# Altium project PSU.PrjPcb
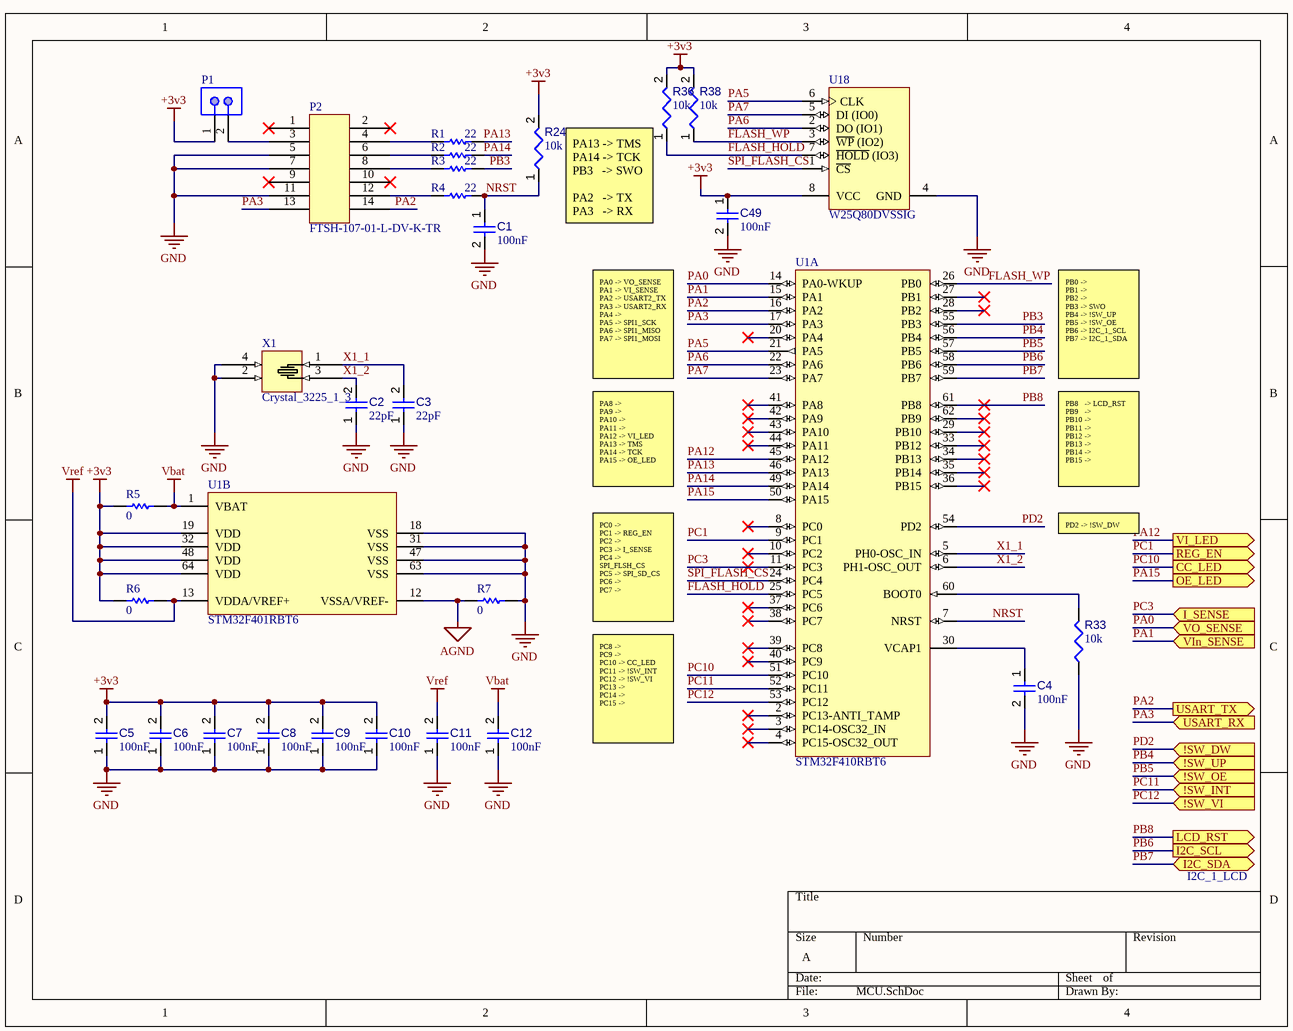
[diagram p0: MCU.SchDoc]
3 sheets, 127 parts. Net scope: flat (ports and power ports of the same name join across sheets).
Board file: PCB_V3.PcbDoc
Sheets:
  MCU.SchDoc
  UI.SchDoc
  Power.SchDoc

## Sheet MCU.SchDoc
size A

### Parts
C1  value 100nF  [CAPC2013X95X50ML10T25]  (hidden comment: Capacitor 100 nF +/-10% 50 V 0805)
C2  value 22pF  [CAPC2013X95X50ML10T25]  (hidden comment: Capacitor 100 nF +/-10% 50 V 0805)
C3  value 22pF  [CAPC2013X95X50ML10T25]  (hidden comment: Capacitor 100 nF +/-10% 50 V 0805)
C4  value 100nF  [CAPC2013X95X50ML10T25]  (hidden comment: Capacitor 100 nF +/-10% 50 V 0805)
C5  value 100nF  [CAPC2013X95X50ML10T25]  (hidden comment: Capacitor 100 nF +/-10% 50 V 0805)
C6  value 100nF  [CAPC2013X95X50ML10T25]  (hidden comment: Capacitor 100 nF +/-10% 50 V 0805)
C7  value 100nF  [CAPC2013X95X50ML10T25]  (hidden comment: Capacitor 100 nF +/-10% 50 V 0805)
C8  value 100nF  [CAPC2013X95X50ML10T25]  (hidden comment: Capacitor 100 nF +/-10% 50 V 0805)
C9  value 100nF  [CAPC2013X95X50ML10T25]  (hidden comment: Capacitor 100 nF +/-10% 50 V 0805)
C10  value 100nF  [CAPC2013X95X50ML10T25]  (hidden comment: Capacitor 100 nF +/-10% 50 V 0805)
C11  value 100nF  [CAPC2013X95X50ML10T25]  (hidden comment: Capacitor 100 nF +/-10% 50 V 0805)
C12  value 100nF  [CAPC2013X95X50ML10T25]  (hidden comment: Capacitor 100 nF +/-10% 50 V 0805)
C49  value 100nF  [CAPC2013X95X50LL10T25]  (hidden comment: Capacitor 100 nF +/-10% 50 V 0805)
P1  GRPB021VWVN-RC  [SLIN-GRPB021VWVN-RC_V]  (value not drawn)
P2  FTSH-107-01-L-DV-K-TR  [FTSH-107-01-L-DV-K-TR-Footprint-1]
R1  value 22  [RESC2013X50X35ML15T15]  (hidden comment: Resistor 0R +/- 1% 0805 125 mW)
R2  value 22  [RESC2013X50X35ML15T15]  (hidden comment: Resistor 0R +/- 1% 0805 125 mW)
R3  value 22  [RESC2013X50X35ML15T15]  (hidden comment: Resistor 0R +/- 1% 0805 125 mW)
R4  value 22  [RESC2013X50X35ML15T15]  (hidden comment: Resistor 0R +/- 1% 0805 125 mW)
R5  value 0  [RESC2013X50X35ML15T15]  (hidden comment: Resistor 0R +/- 1% 0805 125 mW)
R6  value 0  [RESC2013X50X35ML15T15]  (hidden comment: Resistor 0R +/- 1% 0805 125 mW)
R7  value 0  [RESC2013X50X35ML15T15]  (hidden comment: Resistor 0R +/- 1% 0805 125 mW)
R24  value 10k  [RESC2013X50X35ML15T15]  (hidden comment: Resistor 10k +/-1% 0805 125 mW)
R33  value 10k  [RESC0805(2012)_L]  (hidden comment: Resistor 470R +/-5% 0805 125 mW)
R36  value 10k  [RESC2013X50X35ML15T15]  (hidden comment: Resistor 10k +/-1% 0805 125 mW)
R38  value 10k  [RESC2013X50X35ML15T15]  (hidden comment: Resistor 10k +/-1% 0805 125 mW)
U1  STM32F410RBT6  [STM-LQFP64_N]  (parts A,B of 2)
U18  W25Q80DVSSIG  [WINB-SOIC-8_L]
X1  Crystal_3225_1_3  [Crystal_3225_1_3-Footprint-1]

### Ports
!SW_DW (in), !SW_INT (in), !SW_OE (in), !SW_UP (in), !SW_VI (in), CC_LED (out), I2C_SCL (out), I2C_SDA (bidir), I_SENSE (in), LCD_RST (out), OE_LED (out), REG_EN (out), USART_RX (in), USART_TX (out), VI_LED (out), VIn_SENSE (in), VO_SENSE (in)

### Nets
+3v3: C5.2 C6.2 C7.2 C8.2 C9.2 C10.2 C49.1 P1.1 R5.1 R6.1 R24.2 R36.2 R38.2 U1.19(VDD) U1.32(VDD) U1.48(VDD) U1.64(VDD) U18.8(VCC)
AGND: R7.1 U1.12(VSSA/VREF-)
GND: C1.2 C2.1 C3.1 C4.2 C5.1 C6.1 C7.1 C8.1 C9.1 C10.1 C11.1 C12.1 C49.2 P2.5 P2.7 P2.11 R7.2 R33.1 U1.18(VSS) U1.31(VSS) U1.47(VSS) U1.63(VSS) U18.4(GND) X1.2(GND) X1.4(GND)
Vbat: C12.2 R5.2 U1.1(VBAT)
Vref: C11.2 R6.2 U1.13(VDDA/VREF+)
FLASH_HOLD: R36.1 U1.25(PC5) U18.7(~{HOLD}_(IO3))
FLASH_WP: R38.1 U1.26(PB0) U18.3(~{WP}_(IO2))
NRST: C1.1 R4.2 R24.1 U1.7(NRST)
PA0: U1.14(PA0-WKUP) ; port VO_SENSE
PA1: U1.15(PA1) ; port VIn_SENSE
PA2: P2.14 U1.16(PA2) ; port USART_TX
PA3: P2.13 U1.17(PA3) ; port USART_RX
PA5: U1.21(PA5) U18.6(CLK)
PA6: U1.22(PA6) U18.2(DO_(IO1))
PA7: U1.23(PA7) U18.5(DI_(IO0))
PA12: U1.45(PA12) ; port VI_LED
PA13: R1.2 U1.46(PA13)
PA14: R2.2 U1.49(PA14)
PA15: U1.50(PA15) ; port OE_LED
PB3: R3.2 U1.55(PB3)
PB4: U1.56(PB4) ; port !SW_UP
PB5: U1.57(PB5) ; port !SW_OE
PB6: U1.58(PB6) ; port I2C_SCL
PB7: U1.59(PB7) ; port I2C_SDA
PB8: U1.61(PB8) ; port LCD_RST
PC1: U1.9(PC1) ; port REG_EN
PC3: U1.11(PC3) ; port I_SENSE
PC10: U1.51(PC10) ; port CC_LED
PC11: U1.52(PC11) ; port !SW_INT
PC12: U1.53(PC12) ; port !SW_VI
PD2: U1.54(PD2) ; port !SW_DW
SPI_FLASH_CS: U1.24(PC4) U18.1(~{CS})
X1_1: C3.2 U1.5(PH0-OSC_IN) X1.1(X1)
X1_2: C2.2 U1.6(PH1-OSC_OUT) X1.3(X2)
NetC4_1: C4.1 U1.30(VCAP1)
NetP1_2: P1.2 P2.3
NetP2_4: P2.4 R1.1
NetP2_6: P2.6 R2.1
NetP2_8: P2.8 R3.1
NetP2_12: P2.12 R4.1
NetR33_2: R33.2 U1.60(BOOT0)

Not connected (* = marked no-connect by the designer): P2 1* 2* 9* 10*; U1 2(PC13-ANTI_TAMP)* 3(PC14-OSC32_IN)* 4(PC15-OSC32_OUT)* 8(PC0)* 10(PC2)* 20(PA4)* 27(PB1)* 28(PB2)* 29(PB10)* 33(PB12)* 34(PB13)* 35(PB14)* 36(PB15)* 37(PC6)* 38(PC7)* 39(PC8)* 40(PC9)* 41(PA8)* 42(PA9)* 43(PA10)* 44(PA11)* 62(PB9)*

### Notes on the sheet
- (near R36) PA13 -> TMS
  PA14 -> TCK
  PB3   -> SWO
  PA2   -> TX
  PA3   -> RX
- PA0 -> VO_SENSE
  PA1 -> VI_SENSE
  PA2 -> USART2_TX
  PA3 -> USART2_RX
  PA4 ->
  PA5 -> SPI1_SCK
  PA6 -> SPI1_MISO
  PA7 -> SPI1_MOSI
- PB0 ->
  PB1 ->
  PB2 ->
  PB3 -> SWO
  PB4 -> !SW_UP
  PB5 -> !SW_OE
  PB6 -> I2C_1_SCL
  PB7 -> I2C_1_SDA
- PA8 ->
  PA9 ->
  PA10 ->
  PA11 ->
  PA12 -> VI_LED
  PA13 -> TMS
  PA14 -> TCK
  PA15 -> OE_LED
- PB8   -> LCD_RST
  PB9   ->
  PB10 ->
  PB11 ->
  PB12 ->
  PB13 ->
  PB14 ->
  PB15 ->
- PD2 -> !SW_DW
- PC0 ->
  PC1 -> REG_EN
  PC2 ->
  PC3 -> I_SENSE
  PC4 -> SPI_FLSH_CS
  PC5 -> SPI_SD_CS
  PC6 ->
  PC7 ->
- PC8 ->
  PC9 ->
  PC10 -> CC_LED
  PC11 -> !SW_INT
  PC12 -> !SW_VI
  PC13 ->
  PC14 ->
  PC15 ->
- I2C_1_LCD

### Library data of the parts
C1-C12 = CMP-001-00018-4: Chip Capacitor, 100 nF, +/- 10%, 50 V, 0805 (2012 Metric); Voltage Rating: 50V; Capacitor Type: Ceramic; RoHS Compliant: True; Max Operating Temperature: 125°C; Mounting Technology: SM; Case/Package: 0805; Tolerance: 10%; Min Operating Temperature: -55°C; Pins: 2
C49 = CMP-001-00018-6: Chip Capacitor, 100 nF, +/- 10%, 50 V, 0805 (2012 Metric); Capacitor Type: Ceramic; Voltage Rating: 50V; Pins: 2; Max Operating Temperature: 125°C; Min Operating Temperature: -55°C; Mounting Technology: SM; Case/Package: 0805; RoHS Compliant: True; Tolerance: 10%
P1 = CMP-2000-06371-1: Male Header, Pitch 1.27 mm, 1 x 2 Position, Height 4 mm, Tail Length 2.3 mm, -40 to 105 degC, RoHS, Bulk; Manufacturer: Sullins; Dynamic Catalog: GRPB; Number of Positions Loaded: All; Other Names: S9014E-02; Connector Type: Header,Unshrouded; Catalog Drawings: S9014ESeriesTop; Number of Positions: 2; Pitch: 0.050"(1.27mm); Contact Finish Thickness: Flash; Package Description: Male Header, Pitch 1.27 mm, 1 x 2 Position, Height 4 mm, Tail Length 2.3 mm; Datasheet URL: http://www.sullinscorp.com/drawings/71_GRPB___1VWVN-RC,_10957-C.pdf; Contact Mating Length: 0.118"(3.00mm); Manufacturer URL: http://www.sullinscorp.com/; Mounting Type: ThroughHole; Termination: Solder; Category: Connectors,Interconnects; Family: RectangularConnectors-Headers,MalePins; Contact Finish: Gold; Standard Package: 1; Contact Type: MalePin; Packaging: Bulk; Number of Rows: 1; Mounting Technology: ThroughHole; Package Reference: GRPB021VWVN-RC; Datasheet Version: Rev. C, 12/2008
P2 = CMP-002-00072-1: Conn Unshrouded Header HDR 14 POS 1.27mm Solder ST SMD T/R
R1-R7 = CMP-009-00001-4: Chip Resistor, 0 Ohm, +/- 1%, 125 mW, -55 to 155 degC, 0805 (2012 Metric); Power: 125mW; Voltage Rating: 150V; Tolerance: 1%; Mounting Technology: SM; Min Operating Temperature: -55°C; Case/Package: 0805; Pins: 2; Max Operating Temperature: 155°C; RoHS Compliant: True
R24 R36 R38 = CMP-009-00018-5: Chip Resistor, 10 KOhm, +/- 1%, 125 mW, -55 to 155 degC, 0805 (2012 Metric); Power: 125mW; Voltage Rating: 150V; Tolerance: 1%; Pins: 2; Min Operating Temperature: -55°C; Case/Package: 0805; Max Operating Temperature: 155°C; RoHS Compliant: True; Mounting Technology: SM
R33 = CMP-009-00122-2: Chip Resistor, 470 Ohms, +/-5%, 125 mW, -55 to 155 degC, 0805; Power: 125mW; Tolerance: 5%; Max Operating Temperature: 155°C; Min Operating Temperature: -55°C; Pins: 2; Case/Package: 0805
U1 = CMP-0243-00094-2: ARM Cortex-M4 32-bit MCU+FPU, 105 DMIPS, 128 kB Flash, 64 kB Internal RAM, 48 I/Os, 64-pin LQFP, -40 to 85 degC, Tray; Manufacturer: STMicroelectronics; PartNumber: STM32F401RBT6; Internal RAM Size (kB): 64; FLASH Size (Prog) (kB): 128; Supply Voltage(Vcc) max (V): 3.6; I/Os (High Current): 48; Supply Voltage(Vcc) min (V): 1.8; Operating Frequency(F) (Processor speed) (MHz): 84; Core: ARM Cortex-M4; PackageDescription: 64-Pin Low Profile Quad Flat Package, 10 x 10 mm Body, 0.5 mm Pitch; Mounting Technology: Surface Mount; PackageVersion: Rev. 4, 06/2013; ComponentLink1URL: http://www.st.com/web/en/home.html; ComponentLink3Description: Package Specification; ComponentLink2Description: Datasheet; ComponentLink3URL: http://www.st.com/st-web-ui/static/active/en/resource/technical/document/datasheet/DM00037051.pdf; ComponentLink2URL: http://www.st.com/st-web-ui/static/active/en/resource/technical/document/data_brief/DM00071938.pdf; DatasheetVersion: Rev. 1; Packing: Tray; PackageReference: LQFP64; ComponentLink1Description: Manufacturer URL
U18 = CMP-2000-07408-1: Serial Flash Memory with Dual and Quad SPI, 8 Mbits, 2.7 to 3.6 V, -40 to 85 degC, 8-Pin SOIC (SS), RoHS, Tube; Manufacturer: WinbondElectronics; Speed: 104MHz; Memory Size: 8M(1Mx8); Interface: SPISerial; Memory Type: FLASH-NOR; Voltage - Supply: 2.7V~3.6V; Mounting Technology: SurfaceMount; Datasheet URL: http://www.winbond.com/resource-files/w25q80dv_revg_07212015.pdf?__locale=zh_TW; Family: Memory; Package / Case: 8-SOIC(0.209",5.30mmWidth); Manufacturer URL: http://www.winbond.com/hq/index.html?__locale=en; Format - Memory: FLASH; Series: SpiFlash®; Package Reference: SS-8; Package Description: 8-Pin Small Outline Integrated Circuit, Body 5.28 x 5.28 mm, Pitch 1.27 mm; Supplier Device Package: 8-SOIC; Datasheet Version: Rev. G, 07/2015; Category: IntegratedCircuits(ICs); Packaging: Tube; Operating Temperature: -40°C~85°C(TA)
X1 = CMP-003-00030-1: 3225 crystal

## Sheet UI.SchDoc
size A
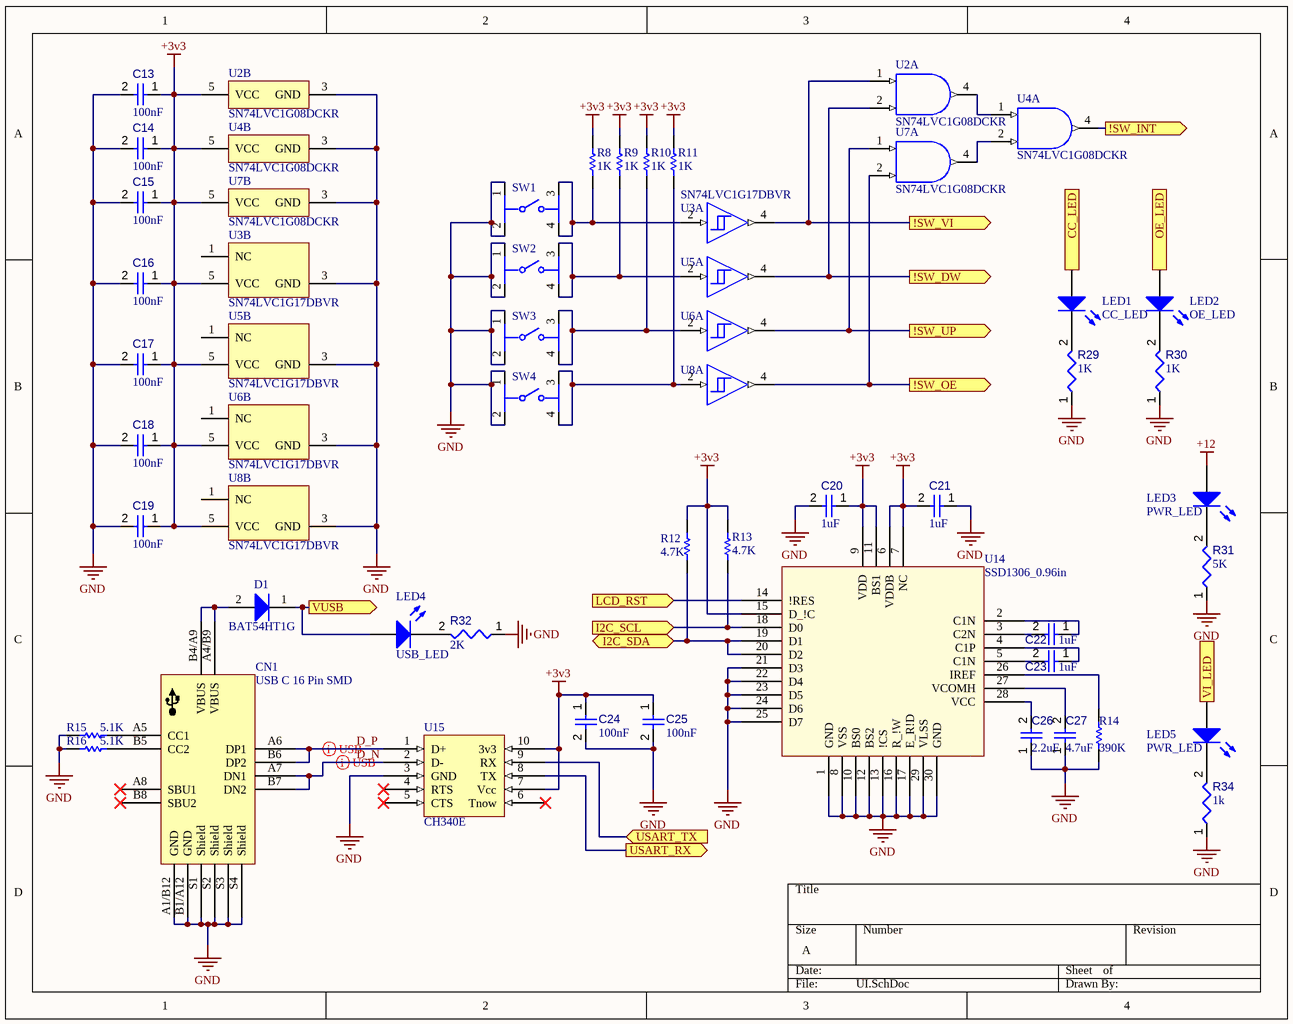
[diagram p1: UI.SchDoc]

### Parts
C13  value 100nF  [CAPC2013X95X50ML10T25]  (hidden comment: Capacitor 100 nF +/-10% 50 V 0805)
C14  value 100nF  [CAPC2013X95X50ML10T25]  (hidden comment: Capacitor 100 nF +/-10% 50 V 0805)
C15  value 100nF  [CAPC2013X95X50ML10T25]  (hidden comment: Capacitor 100 nF +/-10% 50 V 0805)
C16  value 100nF  [CAPC2013X95X50ML10T25]  (hidden comment: Capacitor 100 nF +/-10% 50 V 0805)
C17  value 100nF  [CAPC2013X95X50ML10T25]  (hidden comment: Capacitor 100 nF +/-10% 50 V 0805)
C18  value 100nF  [CAPC2013X95X50ML10T25]  (hidden comment: Capacitor 100 nF +/-10% 50 V 0805)
C19  value 100nF  [CAPC2013X95X50ML10T25]  (hidden comment: Capacitor 100 nF +/-10% 50 V 0805)
C20  value 1uF  [CAPC2013X95X50ML10T25]  (hidden comment: Capacitor 100 nF +/-10% 50 V 0805)
C21  value 1uF  [CAPC2013X95X50ML10T25]  (hidden comment: Capacitor 100 nF +/-10% 50 V 0805)
C22  value 1uF  [CAPC2013X95X50ML10T25]  (hidden comment: Capacitor 100 nF +/-10% 50 V 0805)
C23  value 1uF  [CAPC2013X95X50ML10T25]  (hidden comment: Capacitor 100 nF +/-10% 50 V 0805)
C24  value 100nF  [CAPC2013X95X50ML10T25]  (hidden comment: Capacitor 100 nF +/-10% 50 V 0805)
C25  value 100nF  [CAPC2013X95X50ML10T25]  (hidden comment: Capacitor 100 nF +/-10% 50 V 0805)
C26  value 2.2uF  [CAPC2013X95X50ML10T25]  (hidden comment: Capacitor 100 nF +/-10% 50 V 0805)
C27  value 4.7uF  [CAPC2013X95X50ML10T25]  (hidden comment: Capacitor 100 nF +/-10% 50 V 0805)
CN1  USB C 16 Pin SMD  [USB C 16 Pin SMD-Footprint-1]
D1  BAT54HT1G  [ONSC-SOD-323-2-477-02_V]
LED1  CC_LED  [0805_A]
LED2  OE_LED  [0805_A]
LED3  PWR_LED  [0805_A]
LED4  USB_LED  [0805_A]
LED5  PWR_LED  [0805_A]
R8  value 1K  [RESC2013X50X35ML15T15]  (hidden comment: Resistor 0R +/- 1% 0805 125 mW)
R9  value 1K  [RESC2013X50X35ML15T15]  (hidden comment: Resistor 0R +/- 1% 0805 125 mW)
R10  value 1K  [RESC2013X50X35ML15T15]  (hidden comment: Resistor 0R +/- 1% 0805 125 mW)
R11  value 1K  [RESC2013X50X35ML15T15]  (hidden comment: Resistor 0R +/- 1% 0805 125 mW)
R12  value 4.7K  [RESC2013X50X35ML15T15]  (hidden comment: Resistor 0R +/- 1% 0805 125 mW)
R13  value 4.7K  [RESC2013X50X35ML15T15]  (hidden comment: Resistor 0R +/- 1% 0805 125 mW)
R14  value 390K  [RESC2013X50X35ML15T15]  (hidden comment: Resistor 0R +/- 1% 0805 125 mW)
R15  value 5.1K  [RESC2013X50X35ML15T15]  (hidden comment: Resistor 0R +/- 1% 0805 125 mW)
R16  value 5.1K  [RESC2013X50X35ML15T15]  (hidden comment: Resistor 0R +/- 1% 0805 125 mW)
R29  value 1K  [RESC0805(2012)_L]  (hidden comment: Resistor 470R +/-5% 0805 125 mW)
R30  value 1K  [RESC0805(2012)_L]  (hidden comment: Resistor 470R +/-5% 0805 125 mW)
R31  value 5K  [RESC0805(2012)_L]  (hidden comment: Resistor 470R +/-5% 0805 125 mW)
R32  value 2K  [RESC0805(2012)_L]  (hidden comment: Resistor 470R +/-5% 0805 125 mW)
R34  value 1k  [RESC0805(2012)_L]  (hidden comment: Resistor 470R +/-5% 0805 125 mW)
SW1  PTS526SK15SMTR2LFS  [FP-PTS526SK15SMTR2LFS-MFG]  (value not drawn)
SW2  PTS526SK15SMTR2LFS  [FP-PTS526SK15SMTR2LFS-MFG]  (value not drawn)
SW3  PTS526SK15SMTR2LFS  [FP-PTS526SK15SMTR2LFS-MFG]  (value not drawn)
SW4  PTS526SK15SMTR2LFS  [FP-PTS526SK15SMTR2LFS-MFG]  (value not drawn)
U2  SN74LVC1G08DCKR  [DCK0005A_M]  (parts A,B of 2)
U3  SN74LVC1G17DBVR  [DBV0005A_L]  (parts A,B of 2)
U4  SN74LVC1G08DCKR  [DCK0005A_M]  (parts A,B of 2)
U5  SN74LVC1G17DBVR  [DBV0005A_L]  (value not drawn)  (parts A,B of 2)
U6  SN74LVC1G17DBVR  [DBV0005A_L]  (value not drawn)  (parts A,B of 2)
U7  SN74LVC1G08DCKR  [DCK0005A_M]  (parts A,B of 2)
U8  SN74LVC1G17DBVR  [DBV0005A_L]  (value not drawn)  (parts A,B of 2)
U14  SSD1306_0.96in  [SSD1306_0.96in-Footprint-1]
U15  CH340E  [TSSOP50P490X110-10N]

### Ports
!SW_DW (out), !SW_INT (out), !SW_OE (out), !SW_UP (out), !SW_VI (out), CC_LED (in), I2C_SCL (in), I2C_SDA (bidir), LCD_RST (in), OE_LED (in), USART_RX (out), USART_TX (in), VI_LED (in), VUSB (out)

### Nets
+3v3: C13.1 C14.1 C15.1 C16.1 C17.1 C18.1 C19.1 C20.1 C21.2 C24.1 C25.1 R8.2 R9.2 R10.2 R11.2 R12.2 R13.2 U2.5(VCC) U3.5(VCC) U4.5(VCC) U5.5(VCC) U6.5(VCC) U7.5(VCC) U8.5(VCC) U14.6(VDDB) U14.7(NC) U14.9(VDD) U14.11(BS1) U14.15(D_!C) U15.7(Vcc) U15.10(3v3)
+12: LED3.2(A)
GND: C13.2 C14.2 C15.2 C16.2 C17.2 C18.2 C19.2 C20.2 C21.1 C24.2 C25.2 C26.1 C27.1 CN1.A1/B12(GND) CN1.B1/A12(GND) CN1.S1(Shield) CN1.S2(Shield) CN1.S3(Shield) CN1.S4(Shield) R14.2 R15.2 R16.2 R29.1 R30.1 R31.1 R32.1 R34.1 SW1.1 SW1.2 SW2.1 SW2.2 SW3.1 SW3.2 SW4.1 SW4.2 U2.3(GND) U3.3(GND) U4.3(GND) U5.3(GND) U6.3(GND) U7.3(GND) U8.3(GND) U14.1(GND) U14.8(VSS) U14.10(BS0) U14.12(BS2) U14.13(!CS) U14.16(R_!W) U14.17(E_R!D) U14.21(D3) U14.22(D4) U14.23(D5) U14.24(D6) U14.25(D7) U14.29(VLSS) U14.30(GND) U15.3(GND)
D_N: CN1.A7(DN1) CN1.B7(DN2) U15.2(D-)
D_P: CN1.A6(DP1) CN1.B6(DP2) U15.1(D+)
PA2: U15.9(RX) ; port USART_TX
PA3: U15.8(TX) ; port USART_RX
PA12: LED5.2(A) ; port VI_LED
PA15: LED2.2(A) ; port OE_LED
PB4: U6.4(Y) U7.1(A) ; port !SW_UP
PB5: U7.2(B) U8.4(Y) ; port !SW_OE
PB6: R13.1 U14.18(D0) ; port I2C_SCL
PB7: R12.1 U14.19(D1) U14.20(D2) ; port I2C_SDA
PB8: U14.14(!RES) ; port LCD_RST
PC10: LED1.2(A) ; port CC_LED
PC11: U4.4(Y) ; port !SW_INT
PC12: U2.1(A) U3.4(Y) ; port !SW_VI
PD2: U2.2(B) U5.4(Y) ; port !SW_DW
NetC22_1: C22.1 U14.2(C1N)
NetC22_2: C22.2 U14.3(C2N)
NetC23_1: C23.1 U14.4(C1P)
NetC23_2: C23.2 U14.5(C1N)
NetC26_2: C26.2 U14.28(VCC)
NetC27_2: C27.2 U14.27(VCOMH)
NetC38_2: D1.1(K) LED4.2(A) ; port VUSB
NetCN1_A4/B9: CN1.A4/B9(VBUS) CN1.B4/A9(VBUS) D1.2(A)
NetCN1_A5: CN1.A5(CC1) R15.1
NetCN1_B5: CN1.B5(CC2) R16.1
NetLED1_1: LED1.1(K) R29.2
NetLED2_1: LED2.1(K) R30.2
NetLED3_1: LED3.1(K) R31.2
NetLED4_1: LED4.1(K) R32.2
NetLED5_1: LED5.1(K) R34.2
NetR8_1: R8.1 SW1.3 SW1.4 U3.2(A)
NetR9_1: R9.1 SW2.3 SW2.4 U5.2(A)
NetR10_1: R10.1 SW3.3 SW3.4 U6.2(A)
NetR11_1: R11.1 SW4.3 SW4.4 U8.2(A)
NetR14_1: R14.1 U14.26(IREF)
NetU2_4: U2.4(Y) U4.1(A)
NetU4_2: U4.2(B) U7.4(Y)

Not connected (* = marked no-connect by the designer): CN1 A8(SBU1)* B8(SBU2)* H1(S6) H2(S5); U3 1(NC); U5 1(NC); U6 1(NC); U8 1(NC); U14 31(mech); U15 4(RTS)* 5(CTS)* 6(Tnow)*

### Layout directives
differential pair; differential pair class *; differential pair class *: D_P
differential pair: D_N

### Library data of the parts
C13-C27 = CMP-001-00018-4: as C1 on sheet MCU; RoHS Compliant: True; Max Operating Temperature: 125°C; Mounting Technology: SM; Case/Package: 0805; Tolerance: 10%; Min Operating Temperature: -55°C; Pins: 2
CN1 = CMP-002-00071-1: C167321 Jing Extension; ComponentLink1URL: https://datasheet.lcsc.com/szlcsc/1811101520_Jing-Extension-of-the-Electronic-Co-C167321_C167321.pdf; ComponentLink1Description: Datasheet
D1 = CMP-1055-00462-1: Schottky Barrier Diode, 2-Pin SOD-323, Pb-Free, Tape and Reel; Manufacturer: On Semiconductor; Configuration: Single; trr Max (ns): 5; IFSM Max (A): 0.6; ComponentLink3URL: http://www.onsemi.com/pub_link/Collateral/477-02.PDF.1; PackageDescription: 2-Pin SOD, Body 1.7 x 1.25 mm; ComponentLink2URL: http://www.onsemi.cn/pub_link/Collateral/BAT54HT1-D.PDF; ComponentLink3Description: Package Specification; ComponentLink2Description: Datasheet; DatasheetVersion: Rev. 6; PackageReference: SOD-323-2-477-02; RoHS: TRUE; ComponentLink1URL: http://www.onsemi.com/; Packing: Tape and Reel; PartNumber: BAT54HT1G; Mounting Technology: Surface Mount; ComponentLink1Description: Manufacturer URL; PackageVersion: Rev. H, 03/2007
LED1-LED5 = CMP-1426-00010-1: SMD mono-color Chip LED, WL-SMCW, Super Red; Manufacturer: Wuerth Elektronik; PartNumber: 150080SS75000; PackageReference: 0805_A; ComponentLink2URL: http://katalog.we-online.com/led/datasheet/150080SS75000.pdf; ComponentLink1URL: http://www.we-online.com; Color: Super Red; ComponentLink2Description: Datasheet; ComponentLink1Description: Manufacturer URL
R8-R16 = CMP-009-00001-4: as R1 on sheet MCU; Tolerance: 1%; Mounting Technology: SM; Min Operating Temperature: -55°C; Case/Package: 0805; Pins: 2; Max Operating Temperature: 155°C; RoHS Compliant: True
R29-R32 R34 = CMP-009-00122-2: as R33 on sheet MCU; Max Operating Temperature: 155°C; Min Operating Temperature: -55°C; Pins: 2; Case/Package: 0805
SW1-SW4 = CMP-10040-000013-1: TACT 5.2 X 5.2, 1.5 MM H, 260GF,; Manufacturer: C&K; Operating Force: 250gf; Throw Configuration: SPST-NO; Contact Current Rating: 50mA; Standoff Height: 0mm; Contact Resistance: 100mΩ; Voltage Rating Dc: 12V; Electromechanical Life: 200000Cycles; Description: Tactile Switch SPST-NO Top Actuated Surface Mount; Device Class L3: Tactile Switches; Device Class L2: Switches; Temperature: -20°C to +70°C; Temperature Range Low: -20°C; Package: PTS526SK15SMTR2LFS; Temperature Range High: +70°C; ComponentLink2Description: Datasheet; Device Class L1: Electromechanical; Height: 1.65mm; Digikey Description: TACT 5.2 X 5.2, 1.5 MM H, 260GF,; Category: Switch; RoHS: TRUE; Automotive: No; Lead Free: Yes; Manufacturer Part Number: PTS526SK15SMTR2LFS; Octopart: https://octopart.com/pts526+sk15+smtr2+lfs-c%26k+components-100617999; ComponentLink2URL: https://www.ckswitches.com/media/2780/pts526.pdf
U2 U4 U7 = CMP-0859-00266-3: Single 2-Input Positive-AND Gate, DCK0005A, LARGE T&R; Manufacturer: Texas Instruments; tpd @ Nom Voltage(Max)(ns): 4.5,6,4,5; F @ Nom Voltage(Max)(Mhz): 150; ICC @ Nom Voltage(Max)(mA): 0.01; Bits(#): 1; VCC(Min)(V): 1.65; Gate Type: AND; Rating: Catalog; Output Type: CMOS; Voltage(Nom)(V): 1.8,2.5,3.3,5; Technology Family: LVC; VCC(Max)(V): 5.5; Input Type: CMOS/TTL; Schmitt Trigger: No; Output Drive (IOL/IOH)(Max)(mA): 32/-32; Logic: True; Generic Part Number: SN74LVC1G08; DatasheetVersion: SCES217Y; Sub-Family: AND Gate; 3-State Output: No; Operating Temperature Range(C): -40 to 125,-40 to 85; PackageReference: DCK0005A
U3 U5 U6 U8 = CMP-0859-00033-4: Single Schmitt-Trigger Buffer, DBV0005A, LARGE T&R; Manufacturer: Texas Instruments; Output Drive (IOL/IOH)(Max)(mA): 32/-32; Technology Family: LVC; ICC @ Nom Voltage(Max)(mA): 0.01; VCC(Min)(V): 1.65; F @ Nom Voltage(Max)(Mhz): 150; Schmitt Trigger: Yes; Voltage(Nom)(V): 1.8,2.5,3.3,5; 3-State Output: No; Bits(#): 1; VCC(Max)(V): 5.5; Input Type: CMOS/TTL; Logic: True; tpd @ Nom Voltage(Max)(ns): 11,6.5,5.5,5; Output Type: CMOS; Rating: Catalog; Sub-Family: Non-Inverting Buffer/Driver; PackageReference: DBV0005A; DatasheetVersion: SCES351V; Generic Part Number: SN74LVC1G17; Operating Temperature Range(C): -40 to 125,-40 to 85
U14 = CMP-001-0003-2: C91755
U15 = CMP-015-00008-1: USB to UART Converter; Datasheet: https://www.mpja.com/download/35227cpdata.pdf

## Sheet Power.SchDoc
size A
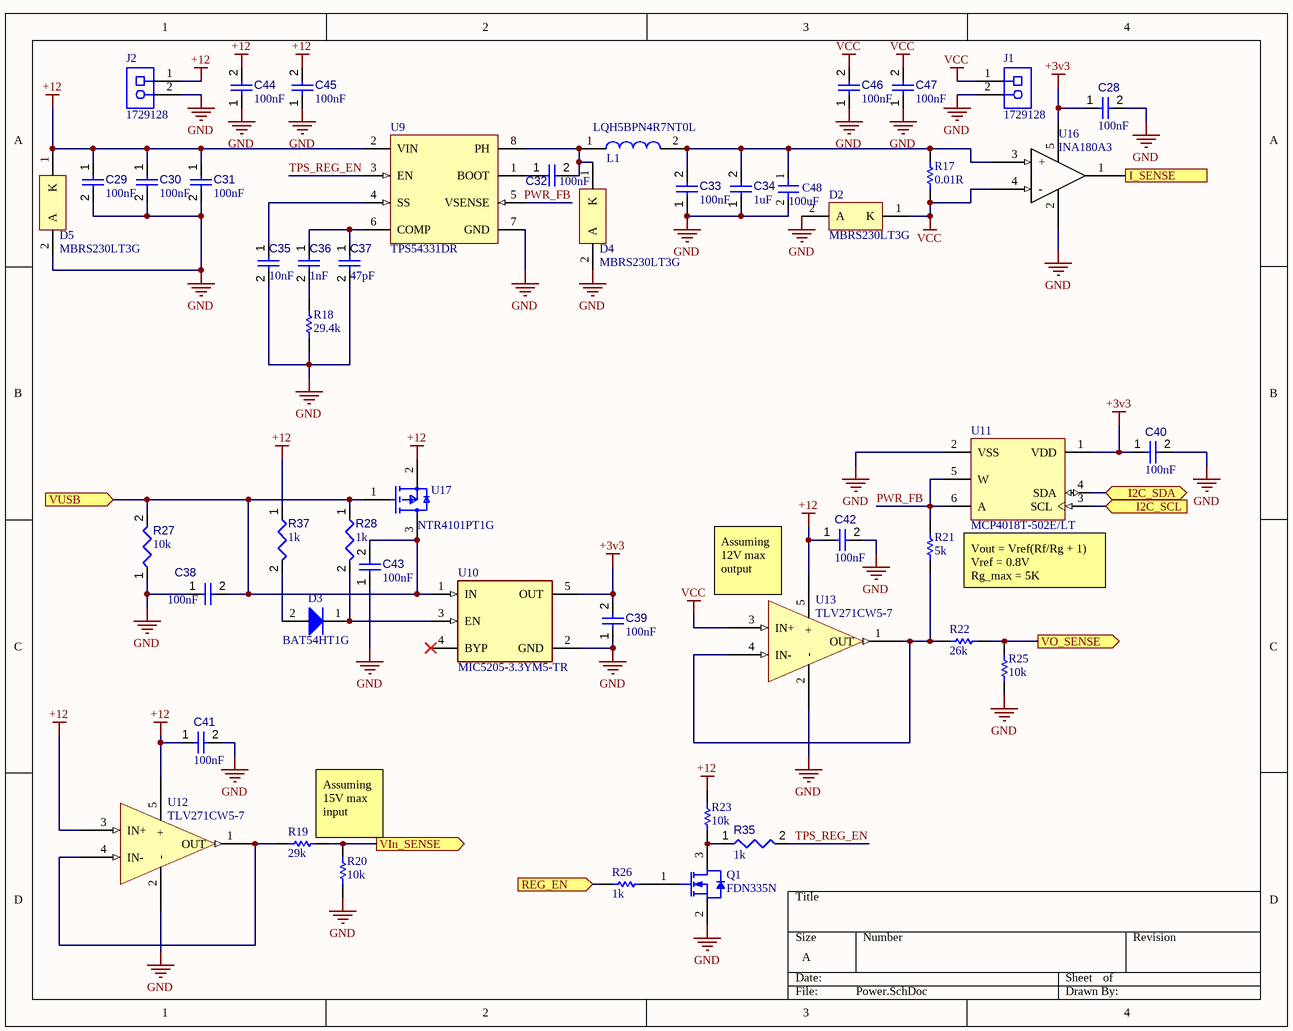
[diagram p2: Power.SchDoc]

### Parts
C28  value 100nF  [CAPC2013X95X50ML10T25]  (hidden comment: Capacitor 100 nF +/-10% 50 V 0805)
C29  value 100nF  [CAPC2013X95X50ML10T25]  (hidden comment: Capacitor 100 nF +/-10% 50 V 0805)
C30  value 100nF  [CAPC2013X95X50ML10T25]  (hidden comment: Capacitor 100 nF +/-10% 50 V 0805)
C31  value 100nF  [CAPC2013X95X50ML10T25]  (hidden comment: Capacitor 100 nF +/-10% 50 V 0805)
C32  value 100nF  [CAPC2013X95X50ML10T25]  (hidden comment: Capacitor 100 nF +/-10% 50 V 0805)
C33  value 100nF  [CAPC2013X95X50ML10T25]  (hidden comment: Capacitor 100 nF +/-10% 50 V 0805)
C34  value 1uF  [CAPC2013X95X50ML10T25]  (hidden comment: Capacitor 100 nF +/-10% 50 V 0805)
C35  value 10nF  [CAPC2013X95X50ML10T25]  (hidden comment: Capacitor 100 nF +/-10% 50 V 0805)
C36  value 1nF  [CAPC2013X95X50ML10T25]  (hidden comment: Capacitor 100 nF +/-10% 50 V 0805)
C37  value 47pF  [CAPC2013X95X50ML10T25]  (hidden comment: Capacitor 100 nF +/-10% 50 V 0805)
C38  value 100nF  [CAPC2013X95X50ML10T25]  (hidden comment: Capacitor 100 nF +/-10% 50 V 0805)
C39  value 100nF  [CAPC2013X95X50ML10T25]  (hidden comment: Capacitor 100 nF +/-10% 50 V 0805)
C40  value 100nF  [CAPC2013X95X50ML10T25]  (hidden comment: Capacitor 100 nF +/-10% 50 V 0805)
C41  value 100nF  [CAPC2013X95X50ML10T25]  (hidden comment: Capacitor 100 nF +/-10% 50 V 0805)
C42  value 100nF  [CAPC2013X95X50ML10T25]  (hidden comment: Capacitor 100 nF +/-10% 50 V 0805)
C43  value 100nF  [CAPC0805(2012)145_L]  (hidden comment: Capacitor 100µF +/-20% 6.3V 0805)
C44  value 100nF  [CAPC2013X95X50LL10T25]  (hidden comment: Capacitor 100 nF +/-10% 50 V 0805)
C45  value 100nF  [CAPC2013X95X50LL10T25]  (hidden comment: Capacitor 100 nF +/-10% 50 V 0805)
C46  value 100nF  [CAPC2013X95X50LL10T25]  (hidden comment: Capacitor 100 nF +/-10% 50 V 0805)
C47  value 100nF  [CAPC2013X95X50LL10T25]  (hidden comment: Capacitor 100 nF +/-10% 50 V 0805)
C48  100uF  [CKG57NX7S1C107M-Footprint-1]
D2  MBRS230LT3G  [ONSC-SMB-2-403A-03_D_V]
D3  BAT54HT1G  [ONSC-SOD-323-2-477-02_V]
D4  MBRS230LT3G  [ONSC-SMB-2-403A-03_D_V]
D5  MBRS230LT3G  [ONSC-SMB-2-403A-03_D_V]
J1  1729128  [PHOE-1729128-2_V]
J2  1729128  [PHOE-1729128-2_V]
L1  LQH5BPN4R7NT0L  [LQH5BPN4R7NT0L-Footprint-1]
Q1  FDN335N  [FAIR-SSOT3L-3_V]
R17  value 0.01R  [RESC3216X60X45ML15T20]  (hidden comment: Resistor 0R +/- 5% 1206 250 mW)
R18  value 29.4k  [RESC2013X50X35ML15T15]  (hidden comment: Resistor 0R +/- 1% 0805 125 mW)
R19  value 29k  [RESC2013X50X35ML15T15]  (hidden comment: Resistor 0R +/- 1% 0805 125 mW)
R20  value 10k  [RESC2013X50X35ML15T15]  (hidden comment: Resistor 0R +/- 1% 0805 125 mW)
R21  value 5k  [RESC2013X50X35ML15T15]  (hidden comment: Resistor 0R +/- 1% 0805 125 mW)
R22  value 26k  [RESC2013X50X35ML15T15]  (hidden comment: Resistor 0R +/- 1% 0805 125 mW)
R23  value 10k  [RESC2013X50X35ML15T15]  (hidden comment: Resistor 0R +/- 1% 0805 125 mW)
R25  value 10k  [RESC2013X50X35ML15T15]  (hidden comment: Resistor 0R +/- 1% 0805 125 mW)
R26  value 1k  [RESC2013X50X35ML15T15]  (hidden comment: Resistor 0R +/- 1% 0805 125 mW)
R27  value 10k  [RESC2013X50X35ML15T15]  (hidden comment: Resistor 10k +/-1% 0805 125 mW)
R28  value 1k  [RESC2013X50X35ML15T15]  (hidden comment: Resistor 10k +/-1% 0805 125 mW)
R35  value 1k  [RESC2013X50X35ML15T15]  (hidden comment: Resistor 10k +/-1% 0805 125 mW)
R37  value 1k  [RESC2013X50X35ML15T15]  (hidden comment: Resistor 10k +/-1% 0805 125 mW)
U9  TPS54331DR  [D0008A_L]
U10  MIC5205-3.3YM5-TR  [FP-M5-IPC_C]
U11  MCP4018T-502E/LT  [SC70-LT6_L]
U12  TLV271CW5-7  [SOT95P285X130-5N]
U13  TLV271CW5-7  [SOT95P285X130-5N]
U16  INA180A3  [SOT95P245X110-5N]
U17  NTR4101PT1G  [FP-318-08-MFG]

### Ports
I2C_SCL (in), I2C_SDA (bidir), I_SENSE (out), REG_EN (in), VIn_SENSE (out), VO_SENSE (out), VUSB (in)

### Nets
+3v3: C28.1 C39.2 C40.1 U10.5(OUT) U11.1(VDD) U16.5(Vcc)
+12: C29.1 C30.1 C31.1 C41.1 C42.1 C44.2 C45.2 D5.1(K) J2.1 R23.2 R37.1 U9.2(VIN) U12.3(IN+) U12.5(+) U13.5(+) U17.2(Source)
GND: C28.2 C29.2 C30.2 C31.2 C33.1 C34.1 C35.2 C37.2 C38.1 C39.1 C40.2 C41.2 C42.2 C43.1 C44.1 C45.1 C46.1 C47.1 C48.2 D2.2(A) D4.2(A) D5.2(A) J1.2 J2.2 Q1.2(S) R18.2 R20.1 R25.1 R27.1 U9.7(GND) U10.2(GND) U11.2(VSS) U12.2(-) U13.2(-) U16.2(GND)
VCC: C46.2 C47.2 D2.1(K) J1.1 R17.1 U13.3(IN+) U16.4(-)
PA0: R22.2 R25.2 ; port VO_SENSE
PA1: R19.2 R20.2 ; port VIn_SENSE
PB6: U11.3(SCL) ; port I2C_SCL
PB7: U11.4(SDA) ; port I2C_SDA
PC1: R26.1 ; port REG_EN
PC3: U16.1(out) ; port I_SENSE
PWR_FB: R21.2 U9.5(VSENSE) U11.5(W) U11.6(A)
TPS_REG_EN: R35.2 U9.3(EN)
NetC32_1: C32.1 U9.1(BOOT)
NetC32_2: C32.2 D4.1(K) L1.1 U9.8(PH)
NetC33_2: C33.2 C34.2 C48.1 L1.2 R17.2 U16.3(+)
NetC35_1: C35.1 U9.4(SS)
NetC36_1: C36.1 C37.1 U9.6(COMP)
NetC36_2: C36.2 R18.1
NetC38_2: C38.2 C43.2 R27.2 R28.1 U10.1(IN) U17.1(Gate) U17.3(Drain) ; port VUSB
NetD3_1: D3.1(K) R28.2 U10.3(EN)
NetD3_2: D3.2(A) R37.2
NetQ1_1: Q1.1(G) R26.2
NetQ1_3: Q1.3(D) R23.1 R35.1
NetR19_1: R19.1 U12.1(OUT) U12.4(IN-)
NetR21_1: R21.1 R22.1 U13.1(OUT) U13.4(IN-)

Not connected (* = marked no-connect by the designer): U10 4(BYP)*

### Notes on the sheet
- (near U13) Assuming 12V max output
- Vout = Vref(Rf/Rg + 1)
  Vref = 0.8V
  Rg_max = 5K
- (near R19) Assuming 15V max input

### Library data of the parts
C28-C42 = CMP-001-00018-4: as C1 on sheet MCU; RoHS Compliant: True; Max Operating Temperature: 125°C; Mounting Technology: SM; Case/Package: 0805; Tolerance: 10%; Min Operating Temperature: -55°C; Pins: 2
C43 = CMP-001-00054-3: Chip Capacitor, 100µF +/-20%, 6.3V, 0805, Thickness 1.45 mm; Tolerance: 10%; Pins: 2; Mounting Technology: SMT; Case/Package: 0805; Min Operating Temperature: -55°C; Voltage Rating: 6.3V; Max Operating Temperature: 85°C
C44-C47 = CMP-001-00018-5: Chip Capacitor, 100 nF, +/- 10%, 50 V, 0805 (2012 Metric); Capacitor Type: Ceramic; Voltage Rating: 50V; Tolerance: 10%; RoHS Compliant: True; Mounting Technology: SM; Max Operating Temperature: 125°C; Pins: 2; Case/Package: 0805; Min Operating Temperature: -55°C
C48 = CMP-001-00083-2: 100uF 16V Stacked MLCC / CKG57NX7S1C107M
D2 D4 D5 = CMP-1055-00336-1: Schottky Power Rectifier, 2-Pin SMB, Pb-Free, Tape and Reel; Manufacturer: On Semiconductor; IFSM Max (A): 40; Configuration: Single; ComponentLink1URL: http://www.onsemi.com/; DatasheetVersion: Rev. 3; PartNumber: MBRS230LT3G; Packing: Tape and Reel; PackageReference: SMB-2-403A-03_D; ComponentLink3URL: http://www.onsemi.cn/pub_link/Collateral/MBRS230LT3-D.PDF; ComponentLink1Description: Manufacturer URL; ComponentLink3Description: Package Specification; ComponentLink2Description: Datasheet; Mounting Technology: Surface Mount; PackageVersion: Rev. D; RoHS: TRUE; PackageDescription: 2-Pin Small Molded Package, J-Bend Lead, Body 4.315 x 3.555 mm; ComponentLink2URL: http://www.onsemi.cn/pub_link/Collateral/MBRS230LT3-D.PDF
D3 = CMP-1055-00462-1: as D1 on sheet UI; ComponentLink3URL: http://www.onsemi.com/pub_link/Collateral/477-02.PDF.1; PackageDescription: 2-Pin SOD, Body 1.7 x 1.25 mm; ComponentLink2URL: http://www.onsemi.cn/pub_link/Collateral/BAT54HT1-D.PDF; ComponentLink3Description: Package Specification; ComponentLink2Description: Datasheet; DatasheetVersion: Rev. 6; PackageReference: SOD-323-2-477-02; RoHS: TRUE; ComponentLink1URL: http://www.onsemi.com/; Packing: Tape and Reel; PartNumber: BAT54HT1G; Mounting Technology: Surface Mount; ComponentLink1Description: Manufacturer URL; PackageVersion: Rev. H, 03/2007
J1 J2 = CMP-2000-05815-1: PCB Terminal Block, 13.5 A, 400 V, 2-Pin THD, RoHS, Bulk; Manufacturer: Phoenix Contact; Package Version: 03/2015; No. of Rows: 1; Pitch: 5.08mm; No. of Positions: 2; Voltage Rating: 400V; Current Rating: 13500mA; Manufacturer URL: http://www.phoenixcontact.com/; Datasheet URL: https://datasheet.ciiva.com/16046/1729128-16046181.pdf; RoHS: TRUE; Package URL: https://www.phoenixcontact.com/online/portal/pi/pxc/product_detail_page/!ut/p/b1/3VdJjqNKFDxLH8AFycySyWY2ozFsEPOMMQaDOX1XedGL_1Vdm5YXJleknhSKeBkvI6EA8ncAo3AYoDhBQGco6KN7VURTdemj9us_IEKEZo_YHiPAEWEFmDGOHMORkqKYCORBZxgL7ZoaZYcbFFUZ3fqxSY6GOuxydWUuHqz1ynmMFygu583Bob0Ewr6Sd_l-5m-kAueHiB0jpRwZwe58wwtkpxtMYd_LmGcDRU02dRNEyWt6Y2ti5pSyJ_reIkzIulrqApdnbT11V5jnCKbYNCvhEM1MCpPByat_X379-iThf08CI5GfOPqfBeS3BRoBOdD55AKVv0iLwCMq-2BrzXWSGRH7pUGD9uwXQjiph3xL0DKQwdGa0JImiIOmBNOestqgwTHSSs2oOep-78apyXQBvNi8ZLaFjvjWvcaUEBu0MC6Wbe-d6mB0FAebo2lUWinqYaZs5DAYzV0RP9yitUjnGJ0iI9xhZkT42OCQNUJJhkgWINNQLP2JFP6OpMg3JCVg70jqHT0lvKOnhHf0lPuOnnLf0VPuWx6_dxwUIvwk5WMkT0kLL1mh61l2yZVSzG3pYV_bqo-mj6uMKwKwdnnW8Jh5RTOJzMOA5c-eJDaZQw4mTMPH02PvS_ZAqNVjVTo2WyYLkwH_KU1mmmG5kjRhDqPXLwwVHvVOjCM60-fpXvTDfMGW1PVFVS1r4e4yVDk4ZdNbkUHvqPqQSeian4UD39fNKmachqdJ1NJbyk8rXT9mXTvPk3oE5meulKGgiruPJek-4I9hTT6G8ZLOyRSm2RRVbThERQad5OS28hdt4YW4vG0stgYYzsWsK4_7y6DZMjJSCqri1kyiZR5vD7pwIrNR7QwPHTcLTI5qT7eRlpHrdGiupYlqQDJ7zy_CND8fWWBoLRXxk1RVcXiBQwbTD4Xi7KL-FuO94t9xaqweXzH; PartNumber: 1729128; Package Description: 2-Pin Through Hole Device, Body 8.1 x 10.16 mm, Pitch 5.08 mm; Datasheet Version: 12/2013; Mounting Technology: ThroughHole; Orientation: Horizontal; Package Reference: 1729128-2; Packing: Bulk
L1 = CMP-006-00021-2: 4.7uH 2A 58mOhm 5x5mm inductor Murata; Datasheet: https://datasheet.lcsc.com/szlcsc/1912111437_Murata-Electronics-LQH5BPN4R7NT0L_C171792.pdf
Q1 = CMP-2000-06249-1: N-Channel Specified PowerTrench(R) MOSFET, 2.5 V, 1.7 A, -55 to 150 degC, 3-Pin SSOT3L, RoHS, Tape and Reel; Manufacturer: FairchildSemiconductor; RDS-on: 0.07@4.5VOhm; Typical Fall Time: 3ns; Maximum Drain Source Voltage: 20V; Rad Hard: No; Channel Mode: Enhancement; Package Version: Rev. 3, 05/2015; Maximum Gate Source Voltage: ±8V; Typical Rise Time: 8.5ns; Typical Turn-Off Delay Time: 11ns; Maximum Continuous Drain Current: 1.7A; Channel Type: N; Typical Turn-On Delay Time: 5ns; Packaging: Tape&Reel; Mounting Technology: SurfaceMount; Mounting: SurfaceMount; Manufacturer URL: https://www.fairchildsemi.com/; Datasheet URL: https://www.fairchildsemi.com/datasheets/FD/FDN335N.pdf; Package Description: 3-Pin Small Outline Transistor, Body 2.92 x 1.4 mm, Pitch 0.95 mm; Package URL: https://www.fairchildsemi.com/package-drawings/MA/MA03B.pdf; Datasheet Version: Rev. C, 04/1999; Package Reference: SSOT3L; Package: 3SuperSOT; Operating Temperature: -55to150°C; Category: MOSFET
R17 = CMP-009-00002-4: Chip Resistor, 0 Ohm, +/- 5%, 0.25 W, -55 to 155 degC, 1206 (3216 Metric); Voltage Rating: 200V; Power: 250mW; Case/Package: 1206; Mounting Technology: SM; RoHS Compliant: True; Min Operating Temperature: -55°C; Max Operating Temperature: 155°C; Tolerance: 5%; Pins: 2
R18-R23 R25 R26 = CMP-009-00001-4: as R1 on sheet MCU; Tolerance: 1%; Mounting Technology: SM; Min Operating Temperature: -55°C; Case/Package: 0805; Pins: 2; Max Operating Temperature: 155°C; RoHS Compliant: True
R27 R28 R35 R37 = CMP-009-00018-4: Chip Resistor, 10 KOhm, +/- 1%, 125 mW, -55 to 155 degC, 0805 (2012 Metric); Power: 125mW; Voltage Rating: 150V; RoHS Compliant: True; Mounting Technology: SM; Pins: 2; Case/Package: 0805; Min Operating Temperature: -55°C; Max Operating Temperature: 155°C; Tolerance: 1%
U9 = CMP-0323-00209-3: Buck Step Down Regulator with 3.5 to 28 V Input and 0.8 to 25 V Output, -40 to 150 degC, 8-Pin SOIC (D), Green (RoHS & no Sb/Br); Manufacturer: Texas Instruments; Vin(Max)(V): 28; Duty Cycle(Max)(%): 90; Vin(Min)(V): 3.5; Iq(Typ)(mA): 0.11; SubFamily: Step-Down Regulator; Rating: Catalog; Iout(Max)(A): 3; Regulated Outputs(#): 1; Vout(Max)(V): 25; Vout(Min)(V): 0.8; Code_JEDEC: MS-012AA; DatasheetVersion: SLVS839D; ComponentLink3Description: URL Link1; Topology: Buck; ComponentLink2URL: http://www.ti.com/litv/pdf/msoi002j; Eco-Plan: Green (RoHS & no Sb/Br); ComponentLink1URL: http://www.ti.com/general/docs/lit/getliterature.tsp?genericPartNumber=TPS54331&fileType=pdf; Mounting Technology: Surface Mount; PartNumber: TPS54331DR; ComponentLink3URL: Samples URL:http://www.ti.com/product/tps54331#samples; ComponentLink1Description: Datasheet; PackageVersion: revM, Jun-2011; ComponentLink2Description: Package Specification; PackageDescription: 8-Pin Plastic Small Outline Integrated Circuit, 4.9 x 3.9 mm, Pitch 1.27 mm Pitch; Switch Current Limit(Typ)(A): 3.5; PackageReference: D0008A
U10 = CMP-06324-000014-1: IC REG LINEAR 3.3V 150MA SOT23-5; Manufacturer: Microchip; Number Of Outputs: 1; Output Type: Fixed; Min Supply Voltage: 2.5V; Accuracy Percentage: 2%; Dropout Voltage: 165mV; Max Supply Voltage: 16V; Max Junction Temp: +125°C; Standoff Height: 0mm; Digikey Description: IC REG LINEAR 3.3V 150MA SOT23-5; Output Current: 150mA; Temperature: -40°C to +125°C; Temperature Range High: +125°C; Height: 1.45mm; ComponentLink2URL: http://ww1.microchip.com/downloads/en/DeviceDoc/20005785A.pdf; Mouser Description: LDO Voltage Regulators; Device Class L3: Voltage Regulators - Linear; Package: M5; Temperature Range Low: -40°C; Device Class L1: Integrated Circuits (ICs); ComponentLink2Description: Datasheet; Automotive: No; Ipc Land Pattern Name: SOT95P280X118-5; Octopart: https://octopart.com/mic5205-3.3ym5-tr-microchip-66802130; Device Class L2: Power Management ICs; Manufacturer Part Number: MIC5205-3.3YM5-TR; Lead Free: Yes; RoHS: TRUE
U11 = CMP-0188-00771-2: 7-Bit Single I2C Digital POT with Volatile Memory, 6-pin SC70, Extended Temperature, Tape and Reel; PackageDescription: 6-Lead Plastic Small Outline Transistor (LT) [SC70]; DatasheetVersion: revA, Mar-2009; ComponentLink1URL: http://www.microchip.com/; ComponentLink1Description: Manufacturer URL; ComponentLink3Description: Package Specification; ComponentLink3URL: http://www.microchip.com/stellent/groups/techpub_sg/documents/packagingspec/en012702.pdf; ComponentLink2Description: Datasheet; PackageVersion: revBB, Aug-2009; ComponentLink2URL: http://ww1.microchip.com/downloads/en/DeviceDoc/22147a.pdf; PackageReference: SC70-LT6; RevisionNote: URLs added.
U12 U13 = CMP-014-00003-1: IC OPAMP GP 3MHZ RRO SOT25
U16 = CMP-014-00002-1: Current Sense Amplifier 100V/V; ComponentLink1Description: Datasheet; ComponentLink1URL: https://datasheet.lcsc.com/szlcsc/1811151640_Texas-Instruments-INA180A3IDBVR_C122882.pdf
U17 = CMP-1058-00754-2: MOSFET P-CH 20V 1.8A SOT-23; Threshold Voltage: -720mV; Rise Time: 12.6ns; Turn-Off Delay Time: 30.2ns; Voltage Rating (DC): -20V; Input Capacitance: 675pF; Power Dissipation: 730mW; Current Rating: -3.2A; Turn-On Delay Time: 7.5ns; Gate to Source Voltage (Vgs): 8V; Element Configuration: Single; Number of Elements: 1; On-State Resistance: 70MR; Rds On Max: 85mR; Drain to Source Resistance: 112mR; Height: 0.94mm; Min Operating Temperature: -55°C; Lead Free: Lead Free; Fall Time: 12.6ns; Nominal Vgs: -720mV; REACH SVHC: No SVHC; Number of Pins: 3; Contact Plating: Tin; Case/Package: SOT-23-3; Radiation Hardening: No; Length: 2.9mm; Width: 1.3mm; Package Quantity: 1; Max Operating Temperature: 150°C; Drain to Source Breakdown Voltage: -20V; Max Power Dissipation: 730mW; Packaging: Tape and Reel; Drain to Source Voltage (Vdss): 20V; Continuous Drain Current (ID): -3.2A

## Nets that join several sheets
+3v3: MCU (18 pins), UI (31 pins), Power (6 pins)
+12: UI (LED3.2), Power (16 pins)
GND: MCU (25 pins), UI (57 pins), Power (35 pins)
NetC38_2: UI (D1.1 LED4.2), Power (7 pins)
PA0: MCU (U1.14), Power (R22.2 R25.2)
PA1: MCU (U1.15), Power (R19.2 R20.2)
PA2: MCU (P2.14 U1.16), UI (U15.9)
PA3: MCU (P2.13 U1.17), UI (U15.8)
PA12: MCU (U1.45), UI (LED5.2)
PA15: MCU (U1.50), UI (LED2.2)
PB4: MCU (U1.56), UI (U6.4 U7.1)
PB5: MCU (U1.57), UI (U7.2 U8.4)
PB6: MCU (U1.58), UI (R13.1 U14.18), Power (U11.3)
PB7: MCU (U1.59), UI (R12.1 U14.19 U14.20), Power (U11.4)
PB8: MCU (U1.61), UI (U14.14)
PC1: MCU (U1.9), Power (R26.1)
PC3: MCU (U1.11), Power (U16.1)
PC10: MCU (U1.51), UI (LED1.2)
PC11: MCU (U1.52), UI (U4.4)
PC12: MCU (U1.53), UI (U2.1 U3.4)
PD2: MCU (U1.54), UI (U2.2 U5.4)

## Assembly variants
PSU_W_FLASH_SD: all parts fitted